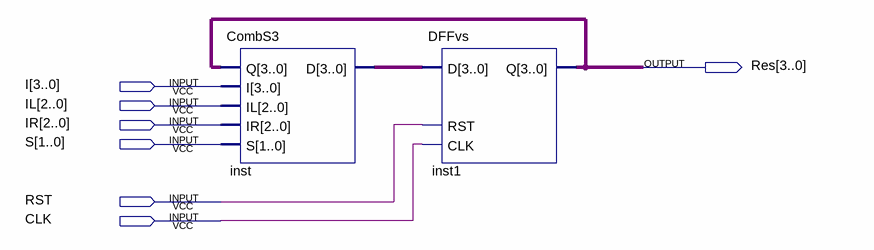
[diagram p0: schematic sheet]
// Quartus schematic VShifter3bit.bdf as structural Verilog: 2 symbols, 7 pins
module VShifter3bit (
  input  [3:0] I,
  input  [2:0] IL,
  input  [2:0] IR,
  input  [1:0] S,
  input  RST,
  input  CLK,
  output [3:0] Res
);

  wire [3:0] inst_d;

  CombS3 inst (.Q(Res), .I(I), .IL(IL), .IR(IR), .S(S), .D(inst_d));
  DFFvs inst1 (.D(inst_d), .RST(RST), .CLK(CLK), .Q(Res));
endmodule
